# EAGLE schematic PlotterServoControl_UpDown (EAGLE 7.3.0)
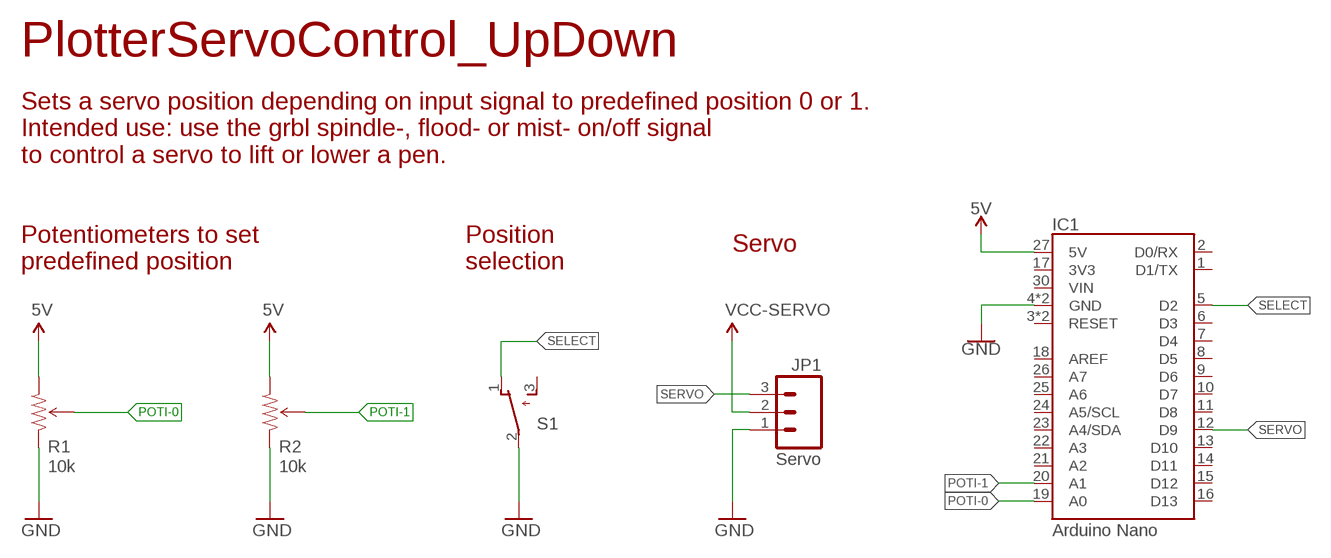
[diagram p0: schematic, sheet 1]

## Parts
IC1  Arduino Nano  NANO_FOOTPRINT  [NANO]
JP1  Servo  M031X03_NO_SILK  [1X03_NO_SILK]
R1  10k  TRIMPOTRES-11156  [TRIMPOT_5MM]
R2  10k  TRIMPOTRES-11156  [TRIMPOT_5MM]
S1  TL32PO  [TL3XPO]

## Nets
5V: IC1.27(5V) R1.C(CW) R2.C(CW)
GND: IC1.4(GND) IC1.29(GND) JP1.1 R1.A(CCW) R2.A(CCW) S1.2(P)
POTI-0: IC1.19(A0) R1.B(WIPER)
POTI-1: IC1.20(A1) R2.B(WIPER)
SELECT: IC1.5(D2) S1.1(O)
SERVO: IC1.12(D9) JP1.3
VCC-SERVO: JP1.2
Unconnected: IC1.1(D1/TX) IC1.2(D0/RX) IC1.3(RESET) IC1.6(D3) IC1.7(D4) IC1.8(D5) IC1.9(D6) IC1.10(D7) IC1.11(D8) IC1.13(D10) IC1.14(D11) IC1.15(D12) IC1.16(D13) IC1.17(3V3) IC1.18(AREF) IC1.21(A2) IC1.22(A3) IC1.23(A4/SDA) IC1.24(A5/SCL) IC1.25(A6) IC1.26(A7) IC1.28(RESET) IC1.30(VIN) S1.3(S)

## Notes on the sheet
- PlotterServoControl_UpDown
- Sets a servo position depending on input signal to predefined position 0 or 1.
  Intended use: use the grbl spindle-, flood- or mist- on/off signal 
  to control a servo to lift or lower a pen.
- Servo
- Potentiometers to set 
  predefined position
- Position 
  selection

## Library data of the parts
IC1 = SparkFun-Boards:NANO_FOOTPRINT: Generic Nano Footprint
JP1 = SparkFun-Connectors:M03: Header 3 Standard 3-pin 0.1" header. Use with straight break away headers (SKU : PRT-00116), right angle break away headers (PRT-00553), swiss pins (PRT-00743), machine pins (PRT-00117), and female headers (PRT-00115). Molex polarized connector foot print use with SKU : PRT-08232 with associated crimp pins and housings.
R1 R2 = SparkFun-Electromechanical:TRIMPOT: Various small potentiometers for "set-and-forget" applications; PROD_ID: RES-11156
S1 = switch:TL32PO: TINY SWITCH ON - MOM Source: http://www2.produktinfo.conrad.com/datenblaetter/700000-724999/705152-da-01-de-Subminiaturschalter_TL_36YO.pdf